# Altium schematic sheet mcu.SchDoc
size A4
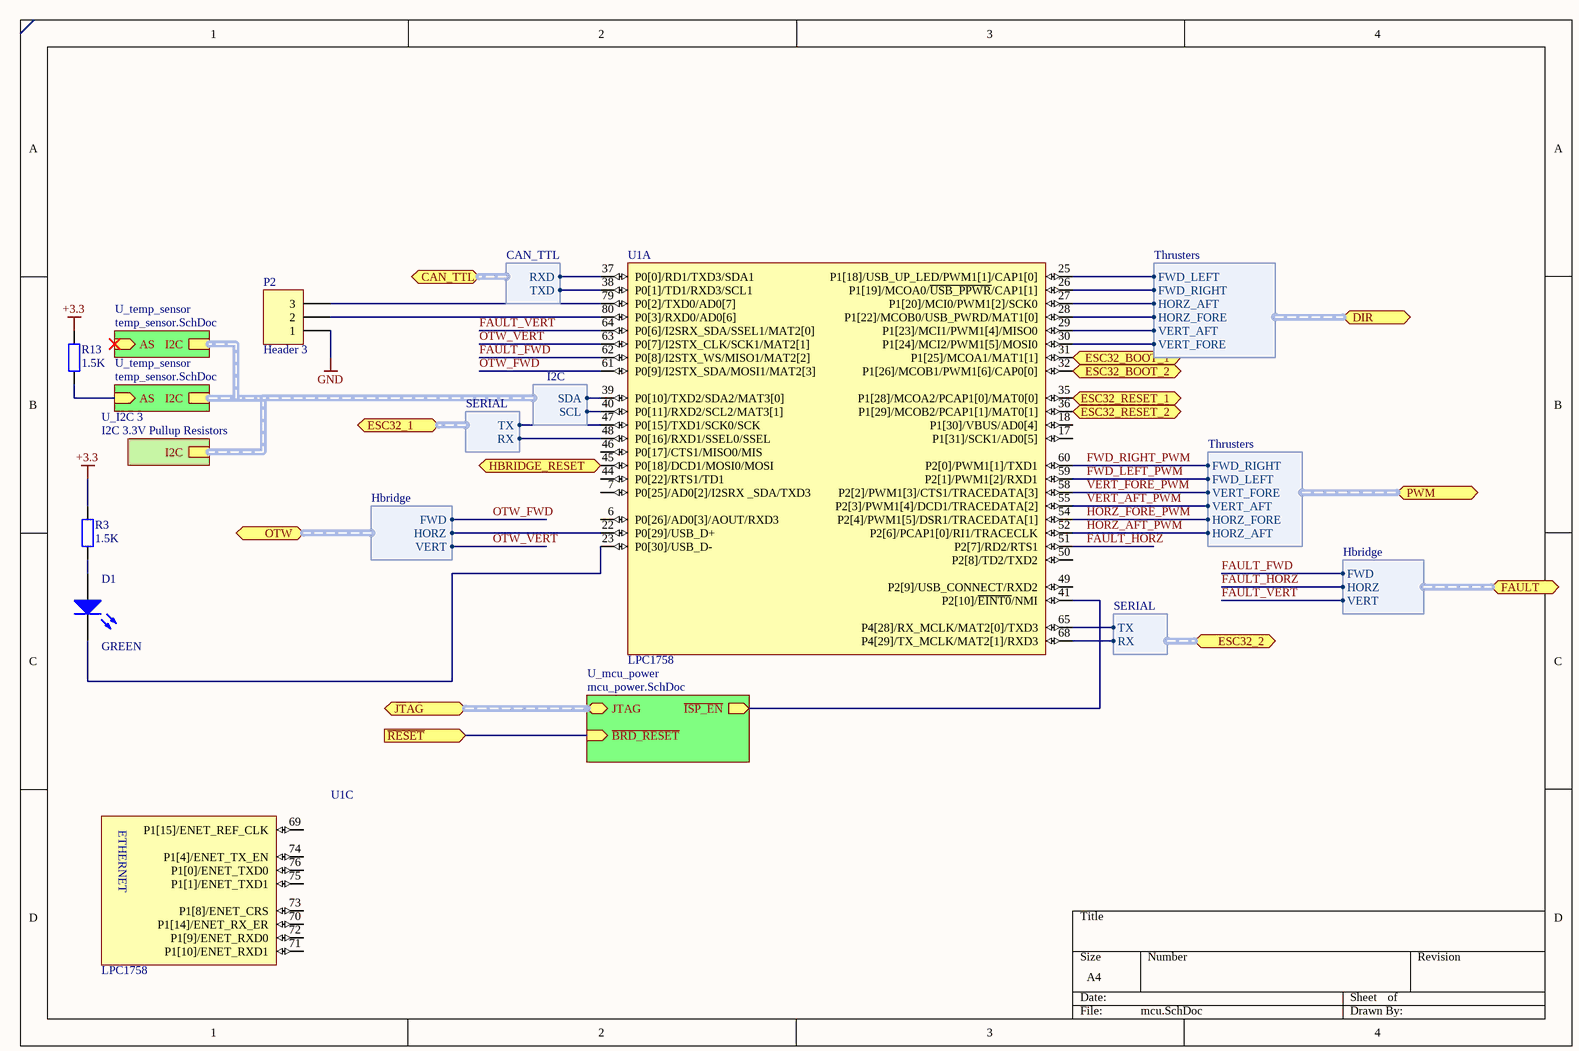
[diagram p0: mcu.SchDoc]

## Parts
D1  value GREEN  [LGQ971]
P2  Header 3  [HDR1X3]
R3  value 1.5K  [R0603]  (hidden comment: Res)
R13  value 1.5K  [R0603]  (hidden comment: Res)
U1  LPC1758  [LPC1758FBD80]  (parts A,C of 3)

## Sub-sheets
U_I2C 3 = I2C 3.3V Pullup Resistors: I2C (harness I2C)
U_mcu_power = mcu_power.SchDoc: JTAG (harness ARM_JTAG), ~{ISP_EN} (out), ~{BRD_RESET} (in)
U_temp_sensor = temp_sensor.SchDoc: I2C (harness I2C), AS (in)
U_temp_sensor = temp_sensor.SchDoc: I2C (harness I2C), AS (in)

## Ports
CAN_TTL (harness CAN_TTL), DIR (harness Thrusters), ESC32_1 (harness SERIAL), ESC32_2 (harness SERIAL), ESC32_BOOT_1 (out), ESC32_BOOT_2 (out), ESC32_RESET_1 (out), ESC32_RESET_2 (out), FAULT (harness Hbridge), HBRIDGE_RESET (out), JTAG (harness ARM_JTAG), OTW (harness Hbridge), PWM (harness Thrusters), ~{RESET} (in)

## Harnesses
CAN_TTL: RXD, TXD
I2C: SCL, SDA
Thrusters: VERT_FORE, HORZ_FORE, VERT_AFT, HORZ_AFT, FWD_LEFT, FWD_RIGHT
Thrusters: FWD_LEFT, FWD_RIGHT, HORZ_AFT, HORZ_FORE, VERT_AFT, VERT_FORE
Hbridge: FWD, HORZ, VERT
SERIAL: TX, RX

## Nets
+3.3: R3.2 R13.2
GND: P2.1
ESC32_BOOT_1: U1.31(P1[25]/MCOA1/MAT1[1]) ; port ESC32_BOOT_1
ESC32_BOOT_2: U1.32(P1[26]/MCOB1/PWM1[6]/CAP0[0]) ; port ESC32_BOOT_2
ESC32_RESET_1: U1.35(P1[28]/MCOA2/PCAP1[0]/MAT0[0]) ; port ESC32_RESET_1
ESC32_RESET_2: U1.36(P1[29]/MCOB2/PCAP1[1]/MAT0[1]) ; port ESC32_RESET_2
FAULT_FWD: U1.62(P0[8]/I2STX_WS/MISO1/MAT2[2]) ; port FAULT.FWD
FAULT_HORZ: U1.51(P2[7]/RD2/RTS1) ; port FAULT.HORZ
FAULT_VERT: U1.64(P0[6]/I2SRX_SDA/SSEL1/MAT2[0]) ; port FAULT.VERT
FWD_LEFT_PWM: U1.59(P2[1]/PWM1[2]/RXD1) ; port PWM.FWD_LEFT
FWD_RIGHT_PWM: U1.60(P2[0]/PWM1[1]/TXD1) ; port PWM.FWD_RIGHT
HBRIDGE_RESET: U1.45(P0[18]/DCD1/MOSI0/MOSI) ; port HBRIDGE_RESET
HORZ_AFT_PWM: U1.52(P2[6]/PCAP1[0]/RI1/TRACECLK) ; port PWM.HORZ_AFT
HORZ_FORE_PWM: U1.54(P2[4]/PWM1[5]/DSR1/TRACEDATA[1]) ; port PWM.HORZ_FORE
OTW_FWD: U1.61(P0[9]/I2STX_SDA/MOSI1/MAT2[3]) ; port OTW.FWD
OTW_VERT: U1.63(P0[7]/I2STX_CLK/SCK1/MAT2[1]) ; port OTW.VERT
~{RESET}: port ~{RESET}, sheet U_mcu_power/~{BRD_RESET}
VERT_AFT_PWM: U1.55(P2[3]/PWM1[4]/DCD1/TRACEDATA[2]) ; port PWM.VERT_AFT
VERT_FORE_PWM: U1.58(P2[2]/PWM1[3]/CTS1/TRACEDATA[3]) ; port PWM.VERT_FORE
NetD1_1: D1.1(A) R3.1
NetD1_2: D1.2(K) U1.23(P0[30]/USB_D-)
NetP2_2: P2.2 U1.80(P0[3]/RXD0/AD0[6])
NetP2_3: P2.3 U1.79(P0[2]/TXD0/AD0[7])
NetR13_1: R13.1 ; sheet U_temp_sensor/AS
NetU1_22: U1.22(P0[29]/USB_D+) ; port OTW.HORZ
NetU1_25: U1.25(P1[18]/USB_UP_LED/PWM1[1]/CAP1[0]) ; port DIR.FWD_LEFT
NetU1_26: U1.26(P1[19]/MCOA0/~{USB_PPWR}/CAP1[1]) ; port DIR.FWD_RIGHT
NetU1_27: U1.27(P1[20]/MCI0/PWM1[2]/SCK0) ; port DIR.HORZ_AFT
NetU1_28: U1.28(P1[22]/MCOB0/USB_PWRD/MAT1[0]) ; port DIR.HORZ_FORE
NetU1_29: U1.29(P1[23]/MCI1/PWM1[4]/MISO0) ; port DIR.VERT_AFT
NetU1_30: U1.30(P1[24]/MCI2/PWM1[5]/MOSI0) ; port DIR.VERT_FORE
NetU1_37: U1.37(P0[0]/RD1/TXD3/SDA1) ; port CAN_TTL.RXD
NetU1_38: U1.38(P0[1]/TD1/RXD3/SCL1) ; port CAN_TTL.TXD
NetU1_39: U1.39(P0[10]/TXD2/SDA2/MAT3[0]) ; sheet U_I2C 3/I2C.SDA
NetU1_40: U1.40(P0[11]/RXD2/SCL2/MAT3[1]) ; sheet U_I2C 3/I2C.SCL
NetU1_41: U1.41(P2[10]/~{EINT0}/NMI) ; sheet U_mcu_power/~{ISP_EN}
NetU1_47: U1.47(P0[15]/TXD1/SCK0/SCK) ; port ESC32_1.TX
NetU1_48: U1.48(P0[16]/RXD1/SSEL0/SSEL) ; port ESC32_1.RX
NetU1_65: U1.65(P4[28]/RX_MCLK/MAT2[0]/TXD3) ; port ESC32_2.TX
NetU1_68: U1.68(P4[29]/TX_MCLK/MAT2[1]/RXD3) ; port ESC32_2.RX

Not connected (* = marked no-connect by the designer): U1 6(P0[26]/AD0[3]/AOUT/RXD3) 7(P0[25]/AD0[2]/I2SRX__SDA/TXD3) 17(P1[31]/SCK1/AD0[5]) 18(P1[30]/VBUS/AD0[4]) 44(P0[22]/RTS1/TD1) 46(P0[17]/CTS1/MISO0/MIS) 49(P2[9]/USB_CONNECT/RXD2) 50(P2[8]/TD2/TXD2) 69(P1[15]/ENET_REF_CLK) 70(P1[14]/ENET_RX_ER) 71(P1[10]/ENET_RXD1) 72(P1[9]/ENET_RXD0) 73(P1[8]/ENET_CRS) 74(P1[4]/ENET_TX_EN) 75(P1[1]/ENET_TXD1) 76(P1[0]/ENET_TXD0)

## Buses and harness runs
harness port JTAG = sheet U_mcu_power/JTAG
harness sheet U_I2C 3/I2C = sheet U_temp_sensor/I2C

## Notes on the sheet
- (in symbol LPC1758, part C) ETHERNET

## Library data of the parts
D1 = LED2: Typical RED, GREEN, YELLOW, AMBER GaAs LED; farnell: 1226372
P2 = Header 3: Header, 3-Pin; LatestRevisionDate: 17-Jul-2002; LatestRevisionNote: Re-released for DXP Platform.; Publisher: Altium Limited
R3 R13 = Res2: Resistor; farnell: 9330607
U1 = LPC1758: NXP - LPC1758FBD80 - MCU, 32BIT, ARM CORTEX M3, 80LQFP; farnell: 1718545